# Altium project stm32f030.PrjPcb
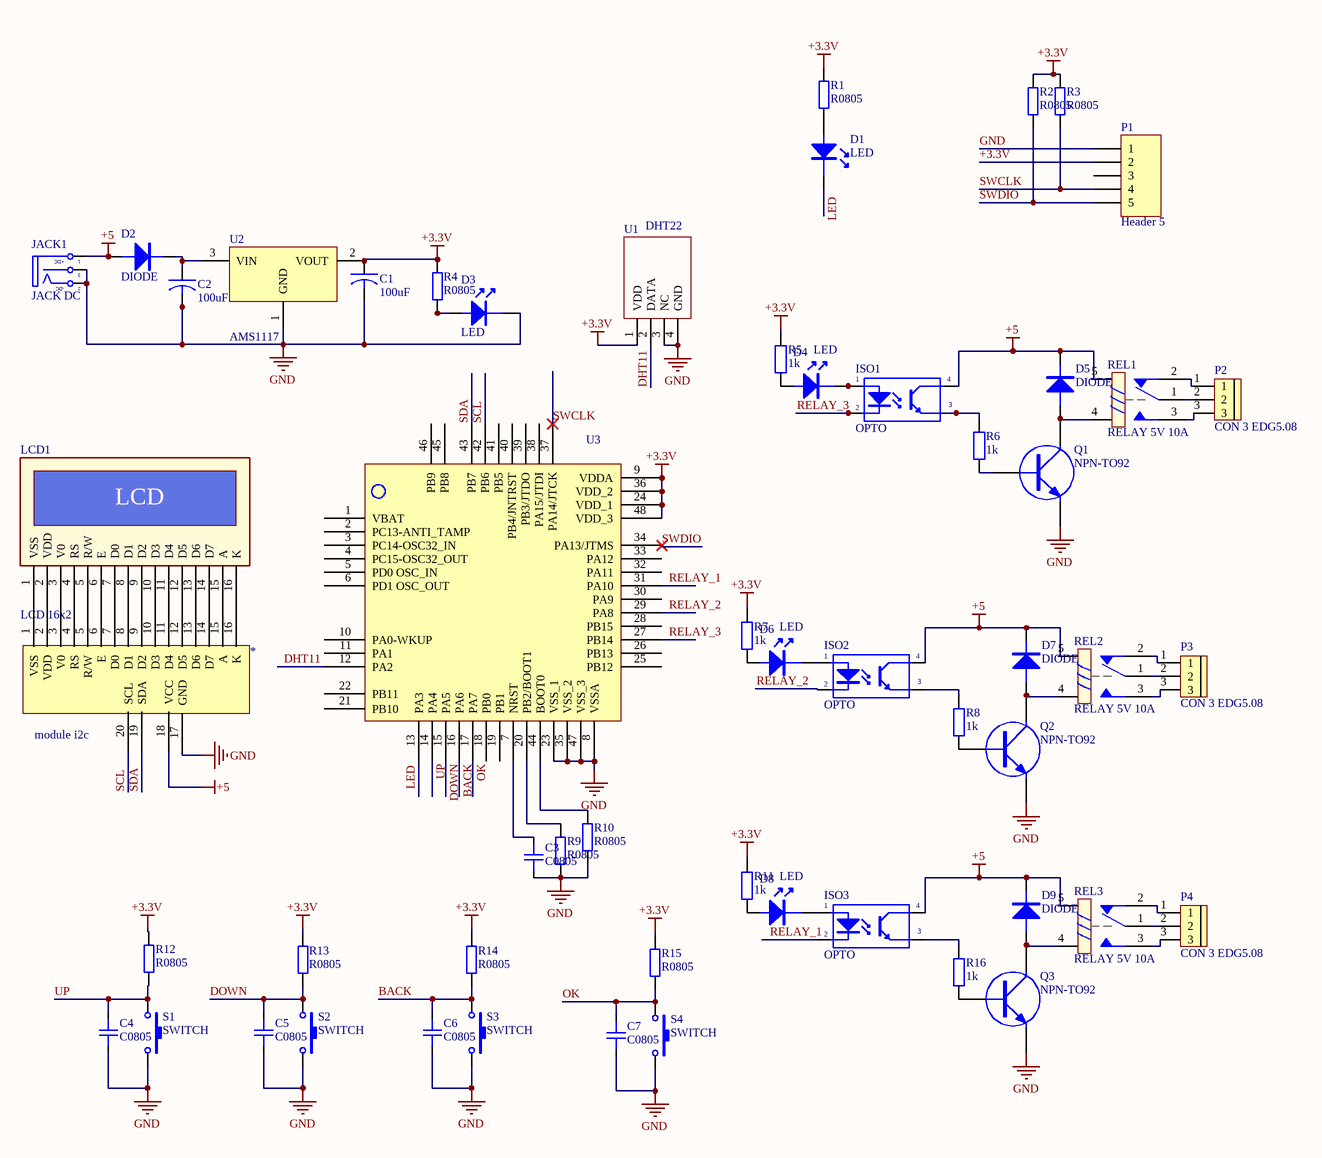
[diagram p0: Sheet1.SchDoc]
1 sheet, 55 parts. Net scope: global (net labels, ports and power ports of the same name join across sheets).
Board file: PCB1.PcbDoc

## Sheet Sheet1.SchDoc
size B; SheetNumber: 1; SheetTotal: 1

### Parts
*  module i2c  [module_i2c]
C1  100uF  [CAP_0805]
C2  100uF  [CAP_0805]
C3  C0805  [CAP_0805]
C4  C0805  [CAP_0805]
C5  C0805  [CAP_0805]
C6  C0805  [CAP_0805]
C7  C0805  [CAP_0805]
D1  LED  [LED5MM RED]
D2  DIODE  [DIODE SMA]
D3  LED  [LED5MM RED]
D4  LED  [LED5MM RED]
D5  DIODE  [DIODE DIP]
D6  LED  [LED5MM RED]
D7  DIODE  [DIODE DIP]
D8  LED  [LED5MM RED]
D9  DIODE  [DIODE DIP]
ISO1  OPTO  [PC817 DIP]
ISO2  OPTO  [PC817 DIP]
ISO3  OPTO  [PC817 DIP]
JACK1  JACK DC  [JACK DC]
LCD1  LCD 16x2  [LCD 16x2-A]
P1  Header 5  [JP 1X5 DT]
P2  CON 3 EDG5.08  [Con 3 KF301 5.08]
P3  CON 3 EDG5.08  [Con 3 KF301 5.08]
P4  CON 3 EDG5.08  [Con 3 KF301 5.08]
Q1  NPN-TO92  [TO-92]
Q2  NPN-TO92  [TO-92]
Q3  NPN-TO92  [TO-92]
R1  R0805  [RES_0805]
R2  R0805  [RES_0805]
R3  R0805  [RES_0805]
R4  R0805  [RES_0805]
R5  1k  [RESISTOR]
R6  1k  [RESISTOR]
R7  1k  [RESISTOR]
R8  1k  [RESISTOR]
R9  R0805  [RES_0805]
R10  R0805  [RES_0805]
R11  1k  [RESISTOR]
R12  R0805  [RES_0805]
R13  R0805  [RES_0805]
R14  R0805  [RES_0805]
R15  R0805  [RES_0805]
R16  1k  [RESISTOR]
REL1  RELAY 5V 10A  [RELAY 5V-10A]
REL2  RELAY 5V 10A  [RELAY 5V-10A]
REL3  RELAY 5V 10A  [RELAY 5V-10A]
S1  SWITCH  [SW 4PIN 12x12x7]
S2  SWITCH  [SW 4PIN 12x12x7]
S3  SWITCH  [SW 4PIN 12x12x7]
S4  SWITCH  [SW 4PIN 12x12x7]
U1  DHT22  [DHT22]
U2  AMS1117  [SOT223 - 3 LEAD]
U3  STM32F103C8T6-LQFP48  [LQFP 48 PIN]  (value not drawn)

### Nets
+3.3V: C1.1 P1.2 R1.1 R2.1 R3.1 R4.1 R5.2 R7.2 R11.2 R12.2 R13.2 R14.2 R15.2 U1.1(VDD) U2.2(VOUT) U3.9(VDDA) U3.24(VDD_1) U3.36(VDD_2) U3.48(VDD_3)
+5: *.18(VCC) D2.1 D5.2 D7.2 D9.2 ISO1.4(C) ISO2.4(C) ISO3.4(C) JACK1.1(T) REL1.5 REL2.5 REL3.5
GND: *.17(GND) C1.2 C2.2 C3.1 C4.2 C5.2 C6.2 C7.2 D3.2 JACK1.2(TN) JACK1.3(S) P1.1 Q1.1(E) Q2.1(E) Q3.1(E) R9.1 R10.1 S1.2 S2.2 S3.2 S4.2 U1.3(NC) U1.4(GND) U2.1(GND) U3.8(VSSA) U3.23(VSS_1) U3.35(VSS_2) U3.47(VSS_3)
BACK: C6.1 R14.1 S3.1 U3.16(PA6)
DHT11: U1.2(DATA) U3.12(PA2)
DOWN: C5.1 R13.1 S2.1 U3.15(PA5)
LED: D1.2 U3.13(PA3)
OK: C7.1 R15.1 S4.1 U3.17(PA7)
RELAY_1: ISO3.2(K) U3.31(PA10)
RELAY_2: ISO2.2(K) U3.29(PA8)
RELAY_3: ISO1.2(K) U3.27(PB14)
SCL: *.20(SCL) U3.42(PB6)
SDA: *.19(SDA) U3.43(PB7)
SWCLK: P1.4 R3.2 U3.37(PA14/JTCK)
SWDIO: P1.5 R2.2 U3.34(PA13/JTMS)
UP: C4.1 R12.1 S1.1 U3.14(PA4)
Net*_1: *.1(VSS) LCD1.1(VSS)
Net*_2: *.2(VDD) LCD1.2(VDD)
Net*_3: *.3(V0) LCD1.3(V0)
Net*_4: *.4(RS) LCD1.4(RS)
Net*_5: *.5(R/W) LCD1.5(R/W)
Net*_6: *.6(E) LCD1.6(E)
Net*_7: *.7(D0) LCD1.7(D0)
Net*_8: *.8(D1) LCD1.8(D1)
Net*_9: *.9(D2) LCD1.9(D2)
Net*_10: *.10(D3) LCD1.10(D3)
Net*_11: *.11(D4) LCD1.11(D4)
Net*_12: *.12(D5) LCD1.12(D5)
Net*_13: *.13(D6) LCD1.13(D6)
Net*_14: *.14(D7) LCD1.14(D7)
Net*_15: *.15(A) LCD1.15(A)
Net*_16: *.16(K) LCD1.16(K)
NetC2_1: C2.1 D2.2 U2.3(VIN)
NetC3_2: C3.2 U3.7(NRST)
NetD1_1: D1.1 R1.2
NetD3_1: D3.1 R4.2
NetD4_1: D4.1 R5.1
NetD4_2: D4.2 ISO1.1(A)
NetD5_1: D5.1 Q1.2(C) REL1.4
NetD6_1: D6.1 R7.1
NetD6_2: D6.2 ISO2.1(A)
NetD7_1: D7.1 Q2.2(C) REL2.4
NetD8_1: D8.1 R11.1
NetD8_2: D8.2 ISO3.1(A)
NetD9_1: D9.1 Q3.2(C) REL3.4
NetISO1_3: ISO1.3(E) R6.1
NetISO2_3: ISO2.3(E) R8.1
NetISO3_3: ISO3.3(E) R16.1
NetP2_1: P2.1 REL1.2
NetP2_2: P2.2 REL1.1
NetP2_3: P2.3 REL1.3
NetP3_1: P3.1 REL2.2
NetP3_2: P3.2 REL2.1
NetP3_3: P3.3 REL2.3
NetP4_1: P4.1 REL3.2
NetP4_2: P4.2 REL3.1
NetP4_3: P4.3 REL3.3
NetQ1_3: Q1.3(B) R6.2
NetQ2_3: Q2.3(B) R8.2
NetQ3_3: Q3.3(B) R16.2
NetR9_2: R9.2 U3.20(PB2/BOOT1)
NetR10_2: R10.2 U3.44(BOOT0)

Not connected (* = marked no-connect by the designer): P1 3; U3 1(VBAT) 2(PC13-ANTI_TAMP) 3(PC14-OSC32_IN) 4(PC15-OSC32_OUT) 5(PD0_OSC_IN) 6(PD1_OSC_OUT) 10(PA0-WKUP) 11(PA1) 18(PB0) 19(PB1) 21(PB10) 22(PB11) 25(PB12) 26(PB13) 28(PB15) 30(PA9) 32(PA11) 33(PA12) 38(PA15/JTDI) 39(PB3/JTDO) 40(PB4/JNTRST) 41(PB5) 45(PB8) 46(PB9)

### Notes on the sheet
- (in symbol JACK DC) +DC; -DC
- (in symbol LCD 16x2) LCD

### Library data of the parts
C1 C2 = CAPACITOR
C3-C7 = CAP_0805: Capacitor SMD 0805; Manufacturer: *; Manufacturer Part Number: *; Distributor Link: *; LCSC: *; Rating: *; Dielectric: *
ISO1-ISO3 = OPTO: Value: TLP5211
JACK1 = JACK DC: Value: Jac DC
P2-P4 = CON 3 EDG5.08: Cắm; Ten_Linh_Kien: CON 3 2EDG5.08-3P 5.08MM ( Xanh Cong); Ma_Hang: MH000760; Ghi_Chu: *; Kieu_Chan: *; Don_Vi: Con; Chung_Loai: Cắm
R1-R4 R9 R10 R12-R15 = RES_0805: Resistor SMD 0805; Manufacturer: *; Manufacturer Part Number: *; Distributor Link: *; LCSC: *
R5-R8 R11 R16 = RESISTOR: Value: R1/4W - 1K
P1 = Header 5: LatestRevisionDate: 17-Jul-2002; LatestRevisionNote: Re-released for DXP Platform.; Publisher: Altium Limited
S1-S4 = SWITCH: Published: 24-Mar-1999; LatestRevisionDate: 17-Jul-2002; LatestRevisionNote: Re-released for DXP Platform.; PackageReference: SPST-2; Publisher: Altium Limited
U3 = STM32F103C8T6-LQFP48: Published: 30-May-2008; DatasheetVersion: rev6, Mar-2008; PackageVersion: Mar-2008; PackageReference: LQFP48; Publisher: Altium Limited; PackageDescription: 48-Pin Low-Profile Quad Flat Pack, 7 x 7 mm Body, 0.5 mm Pitch (LQFP48); ComponentLink1Description: Manufacturer Link; ComponentLink1URL: www.st.com/stm32; ComponentLink2Description: Datasheet; ComponentLink2URL: http://www.st.com/stonline/products/literature/ds/13586.pdf